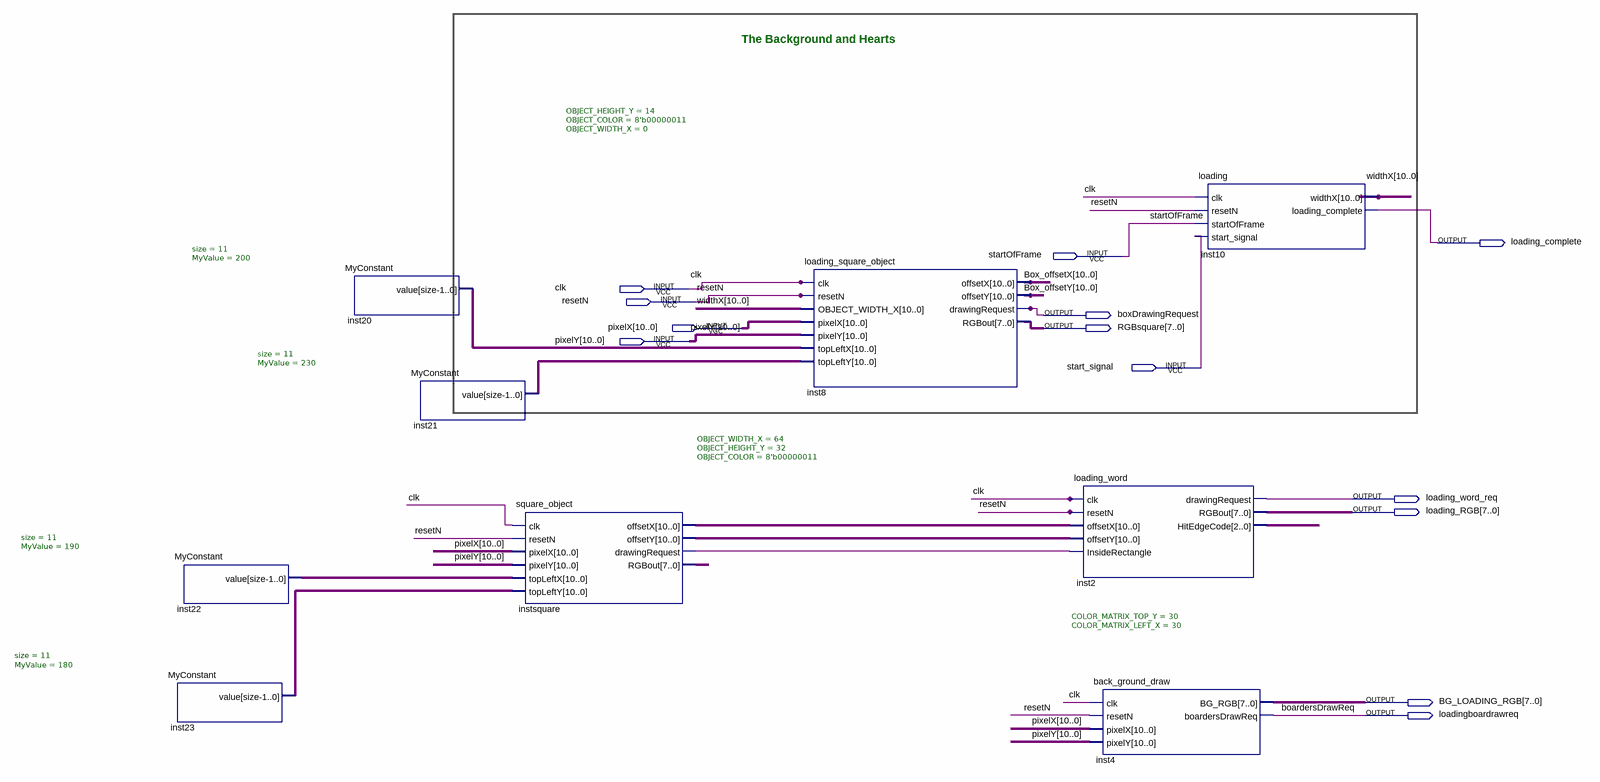
[diagram p0: schematic sheet]
// Quartus schematic Loading_page_top.bdf as structural Verilog: 9 symbols, 13 pins
module Loading_page_top (
  input  startOfFrame,
  input  clk,
  input  resetN,
  input  [10:0] pixelX,
  input  [10:0] pixelY,
  input  start_signal,
  output loading_complete,
  output boxDrawingRequest,
  output [7:0] RGBsquare,
  output loading_word_req,
  output [7:0] loading_RGB,
  output [7:0] BG_LOADING_RGB,
  output loadingboardrawreq
);

  wire instsquare_drawingrequest;
  wire [2:0] inst2_hitedgecode;
  wire [7:0] instsquare_rgbout;
  wire [10:0] Box_offsetX, Box_offsetY, inst20_value, inst21_value, inst22_value, inst23_value,
       instsquare_offsetx, instsquare_offsety, widthX;

  MyConstant #(.size(11), .MyValue(190)) inst22 (.value(inst22_value));
  MyConstant #(.size(11), .MyValue(180)) inst23 (.value(inst23_value));
  MyConstant #(.size(11), .MyValue(200)) inst20 (.value(inst20_value));
  MyConstant #(.size(11), .MyValue(230)) inst21 (.value(inst21_value));
  square_object #(.OBJECT_WIDTH_X(64), .OBJECT_HEIGHT_Y(32), .OBJECT_COLOR(8'b00000011)) instsquare (
    .clk(clk), .resetN(resetN), .pixelX(pixelX), .pixelY(pixelY), .topLeftX(inst22_value),
    .topLeftY(inst23_value), .offsetX(instsquare_offsetx), .offsetY(instsquare_offsety),
    .drawingRequest(instsquare_drawingrequest), .RGBout(instsquare_rgbout));
  loading_square_object #(.OBJECT_HEIGHT_Y(14), .OBJECT_COLOR(8'b00000011), .OBJECT_WIDTH_X(0)) inst8 (
    .clk(clk), .resetN(resetN), .OBJECT_WIDTH_X(widthX), .pixelX(pixelX), .pixelY(pixelY),
    .topLeftX(inst20_value), .topLeftY(inst21_value), .offsetX(Box_offsetX), .offsetY(Box_offsetY),
    .drawingRequest(boxDrawingRequest), .RGBout(RGBsquare));
  loading_word inst2 (
    .clk(clk), .resetN(resetN), .offsetX(instsquare_offsetx), .offsetY(instsquare_offsety),
    .InsideRectangle(instsquare_drawingrequest), .drawingRequest(loading_word_req), .RGBout(loading_RGB),
    .HitEdgeCode(inst2_hitedgecode));
  back_ground_draw #(.COLOR_MATRIX_TOP_Y(30), .COLOR_MATRIX_LEFT_X(30)) inst4 (
    .clk(clk), .resetN(resetN), .pixelX(pixelX), .pixelY(pixelY), .BG_RGB(BG_LOADING_RGB),
    .boardersDrawReq(loadingboardrawreq));
  loading inst10 (
    .clk(clk), .resetN(resetN), .startOfFrame(startOfFrame), .start_signal(start_signal), .widthX(widthX),
    .loading_complete(loading_complete));

  // Other names for the same wires on the sheet: boardersDrawReq = loadingboardrawreq

  // Notes on the sheet:
  //   The Background and Hearts
endmodule
